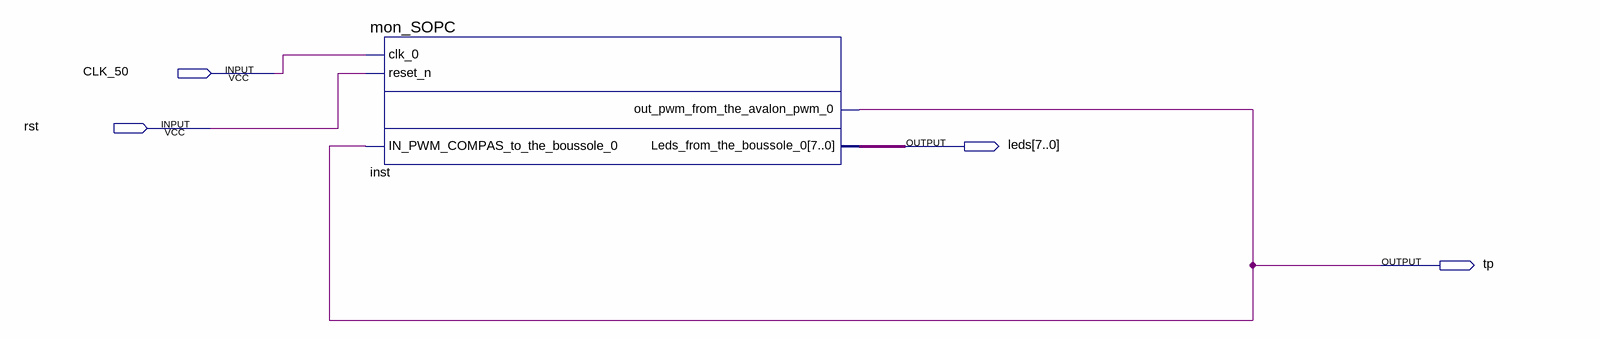
[diagram p0: schematic sheet]
// Quartus schematic Test.bdf as structural Verilog: 1 symbols, 4 pins
module Test (
  input  CLK_50,
  input  rst,
  output [7:0] leds,
  output tp
);

  mon_SOPC inst (
    .clk_0(CLK_50), .reset_n(rst), .IN_PWM_COMPAS_to_the_boussole_0(tp), .out_pwm_from_the_avalon_pwm_0(tp),
    .Leds_from_the_boussole_0(leds));
endmodule
